# EAGLE schematic beaconboard (EAGLE 6.5.0)
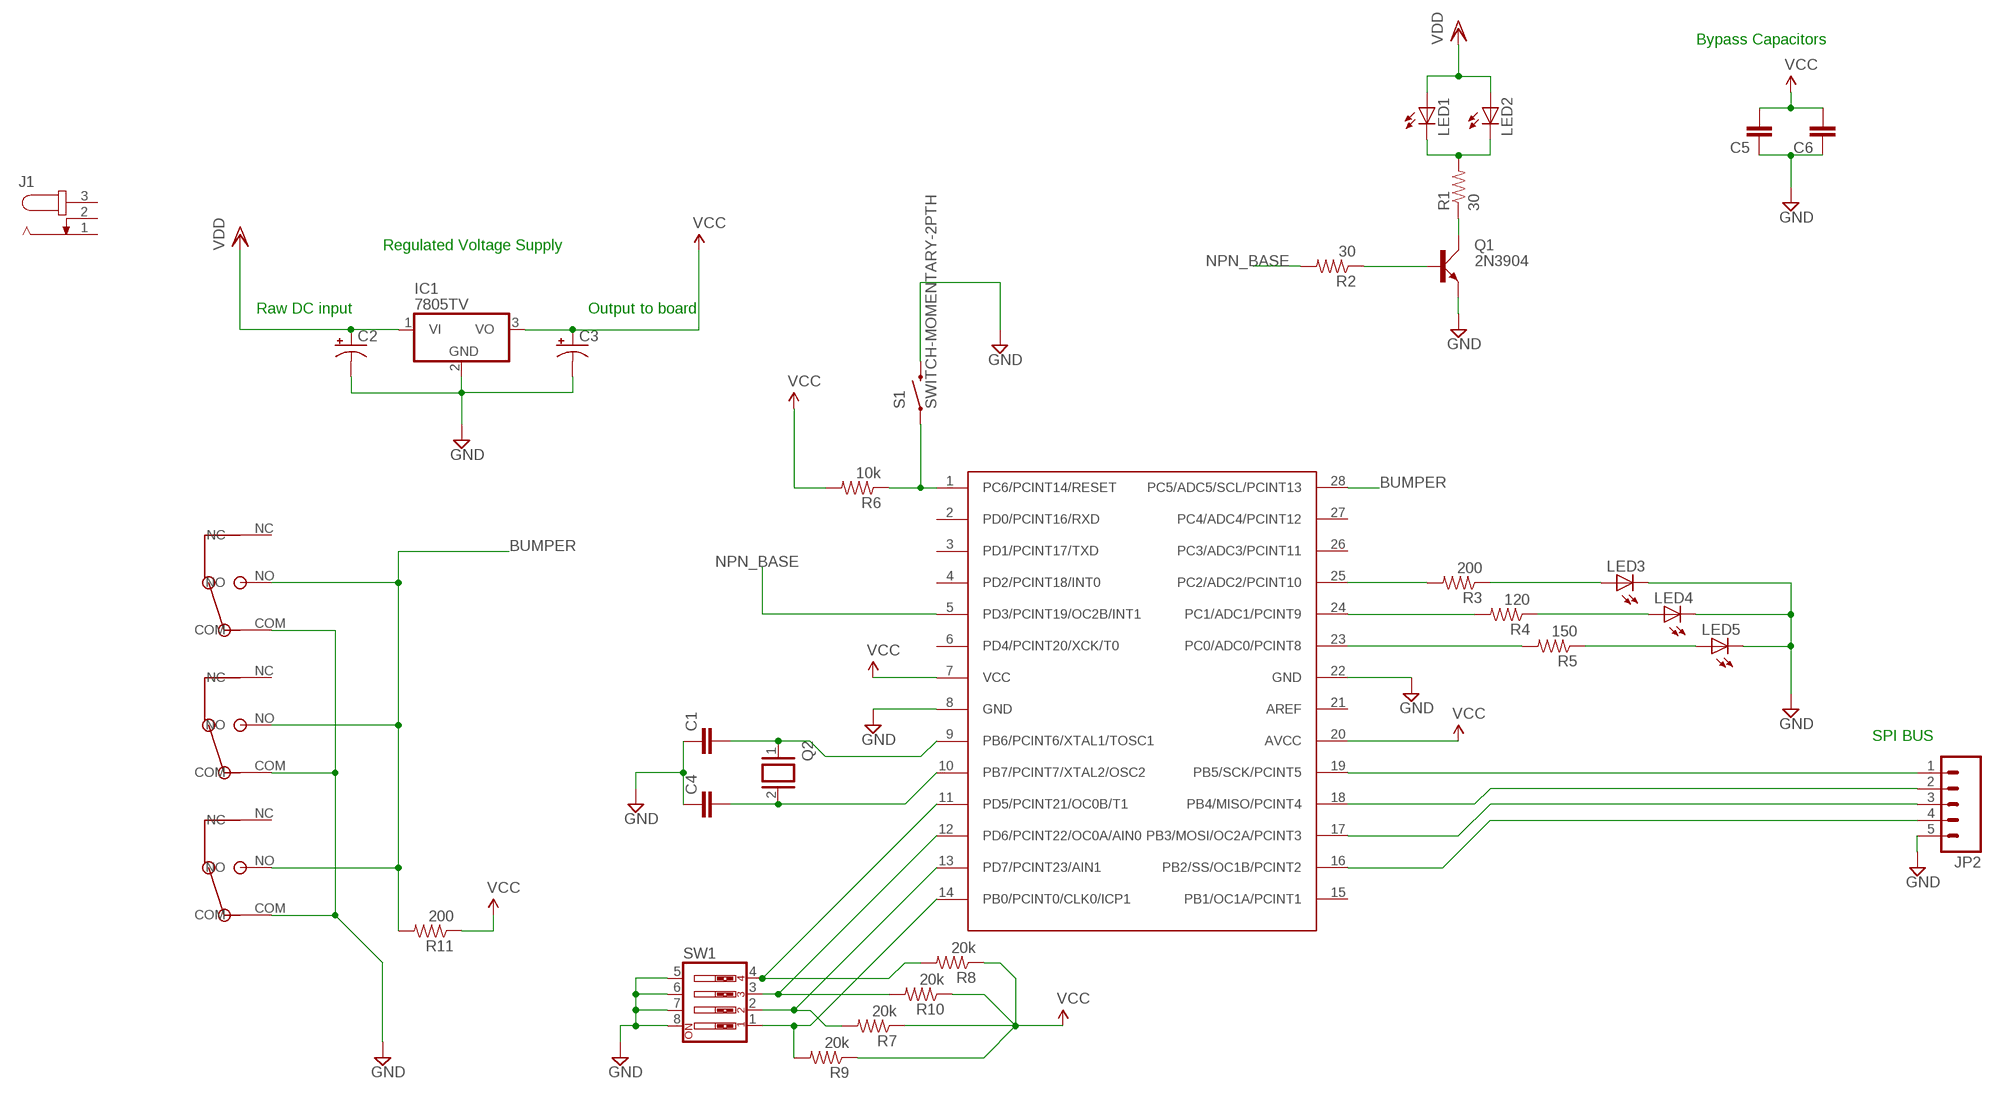
[diagram p0: schematic, sheet 1]

## Parts
C1  CAPPTH  [CAP-PTH-SMALL]
C2  CAP_POLPTH2  [CPOL-RADIAL-10UF-25V]
C3  CAP_POLPTH2  [CPOL-RADIAL-10UF-25V]
C4  CAPPTH  [CAP-PTH-SMALL]
C5  CAPPTH  [CAP-PTH-SMALL]
C6  CAPPTH  [CAP-PTH-SMALL]
IC1  7805TV  [TO220V]
J1  JACK-PLUG1  [SPC4078]
JP2  M05LOCK_LONGPADS  [1X05_LOCK_LONGPADS]
LED1  LED-2AC-CP41B-WES  [CP41B]
LED2  LED-2AC-CP41B-WES  [CP41B]
LED3  LED5MM  [LED5MM]
LED4  LED5MM  [LED5MM]
LED5  LED5MM  [LED5MM]
Q1  2N3904  [TO92D]
Q2  XTAL/S  [QS]
R1  30  RESISTORPTH-1/4W  [AXIAL-0.4]
R2  30  RESISTORPTH-1/4W  [AXIAL-0.4]
R3  200  RESISTORPTH-1/4W  [AXIAL-0.4]
R4  120  RESISTORPTH-1/4W  [AXIAL-0.4]
R5  150  RESISTORPTH-1/4W  [AXIAL-0.4]
R6  10k  RESISTORPTH-1/4W  [AXIAL-0.4]
R7  20k  RESISTORPTH-1/4W  [AXIAL-0.4]
R8  20k  RESISTORPTH-1/4W  [AXIAL-0.4]
R9  20k  RESISTORPTH-1/4W  [AXIAL-0.4]
R10  20k  RESISTORPTH-1/4W  [AXIAL-0.4]
R11  200  RESISTORPTH-1/4W  [AXIAL-0.4]
S1  SWITCH-MOMENTARY-2PTH  [TACTILE-PTH]
SW1  SW_DIP-4  [EDG-04]
U$1  DF2-L  [D2F-L]
U$2  DF2-L  [D2F-L]
U$3  DF2-L  [D2F-L]
U$4  ATMEGA328  [DIL28-3]

## Nets
BUMPER: R11.P$2 U$1.NO U$2.NO U$3.NO U$4.28(PC5/ADC5/SCL/PCINT13)
GND: C1.1 C2.2(-) C3.2(-) C4.1 C5.1 C6.1 IC1.2(GND) JP2.5 LED3.K(C) LED4.K(C) LED5.K(C) Q1.E S1.3 SW1.5 SW1.6 SW1.7 SW1.8 U$1.COM U$2.COM U$3.COM U$4.8(GND) U$4.22(GND)
N$1: Q1.C R1.P$1
N$2: Q1.B R2.P$1
N$3: LED1.1(C) LED1.4(C) LED2.1(C) LED2.4(C) R1.P$2
N$4: R4.P$2 U$4.24(PC1/ADC1/PCINT9)
N$5: JP2.1 U$4.19(PB5/SCK/PCINT5)
N$6: JP2.2 U$4.18(PB4/MISO/PCINT4)
N$7: JP2.3 U$4.17(PB3/MOSI/OC2A/PCINT3)
N$8: LED3.A R3.P$1
N$9: LED4.A R4.P$1
N$10: LED5.A R5.P$1
N$11: R6.P$1 S1.1 U$4.1(PC6/PCINT14/RESET)
N$12: C1.2 Q2.1 U$4.9(PB6/PCINT6/XTAL1/TOSC1)
N$13: C4.2 Q2.2 U$4.10(PB7/PCINT7/XTAL2/OSC2)
N$14: R7.P$2 SW1.2 U$4.13(PD7/PCINT23/AIN1)
N$15: R8.P$2 SW1.4 U$4.11(PD5/PCINT21/OC0B/T1)
N$16: R10.P$2 SW1.3 U$4.12(PD6/PCINT22/OC0A/AIN0)
N$17: R5.P$2 U$4.23(PC0/ADC0/PCINT8)
N$18: R3.P$2 U$4.25(PC2/ADC2/PCINT10)
N$19: R9.P$2 SW1.1 U$4.14(PB0/PCINT0/CLK0/ICP1)
N$20: JP2.4 U$4.16(PB2/SS/OC1B/PCINT2)
NPN_BASE: R2.P$2 U$4.5(PD3/PCINT19/OC2B/INT1)
VCC: C3.1(+) C5.2 C6.2 IC1.3(VO) R6.P$2 R7.P$1 R8.P$1 R9.P$1 R10.P$1 R11.P$1 U$4.7(VCC) U$4.20(AVCC)
VDD: C2.1(+) IC1.1(VI) LED1.2(A) LED1.3(A) LED2.2(A) LED2.3(A)
Unconnected: J1.1 J1.2 J1.3 U$1.NC U$2.NC U$3.NC U$4.2(PD0/PCINT16/RXD) U$4.3(PD1/PCINT17/TXD) U$4.4(PD2/PCINT18/INT0) U$4.6(PD4/PCINT20/XCK/T0) U$4.15(PB1/OC1A/PCINT1) U$4.21(AREF) U$4.26(PC3/ADC3/PCINT11) U$4.27(PC4/ADC4/PCINT12)

## Notes on the sheet
- Bypass Capacitors
- Regulated Voltage Supply
- Raw DC input | Output to board
- SPI BUS

## Library data of the parts
C1 C4-C6 = SparkFun-Passives:CAP: Capacitor Standard 0603 ceramic capacitor, and 0.1" leaded capacitor.
C2 C3 = SparkFun-Capacitors:CAP_POL: Capacitor Polarized These are standard SMD and PTH capacitors. Normally 10uF, 47uF, and 100uF in electrolytic and tantalum varieties. Always verify the external diameter of the through hole cap, it varies with capacity, voltage, and manufacturer. The EIA devices should be standard.
IC1 = linear:78*: Positive VOLTAGE REGULATOR Source: http://cache.national.com/ds/LM/LM78L05.pdf http://www.fairchildsemi.com/ds/LM/LM7805.pdf
J1 = con-jack:JACK-PLUG: DC POWER JACK Power Jack, DC, Right Angle, Through Hole, Rated 5A at 16VDC, PC Terminals Distributor: Farnell (www.Farnell.de) Drawing: 84N1161.pdf / 84N1162.pdf Manufacturer: SPC Technology (www.spctechnology.com) Type: SPC4077 / SPC 4078; OC_FARNELL: unknown; OC_NEWARK: unknown
JP2 = SparkFun-Connectors:M05: Header 5 Standard 5-pin 0.1" header. Use with straight break away headers (SKU : PRT-00116), right angle break away headers (PRT-00553), swiss pins (PRT-00743), machine pins (PRT-00117), and female headers (PRT-00115). Molex polarized connector foot print use with SKU : PRT-08230 with associated crimp pins and housings.
LED1 LED2 = led:LED-2AC-: LEDs with 2 Cathode & 2 Anode - Kingbright SUPER FLUX LED LAMP Source: www.us.kingbright.com/images/catalog/SPEC/W7676CPBC-H.pdf Cree® P4 LED CP41B-WES/WGS Source: Data sheet <http://www.cree.com/products/pdf/LEDlamps/CP41B-WES&WGS.pdf>
LED3-LED5 = SparkFun-LED:LED: LEDs Standard schematic elements and footprints for 5mm, 3mm, 1206, and 0603 sized LEDs. 5mm - Spark Fun Electronics SKU : COM-00529 (and others)
Q1 = transistor-small-signal:2N3904: NPN TRANSISTOR
Q2 = special:XTAL/S: CRYSTAL
R1-R11 = SparkFun-Resistors:RESISTOR: Resistor Basic schematic elements and footprints for 0603, 1206, and PTH resistors.
S1 = SparkFun-Electromechanical:SWITCH-MOMENTARY-2: Various NO switches- pushbuttons, reed, etc
SW1 = special:SW_DIP-4: DIP SWITCH
U$1-U$3 = hmcfabstudio:DF2-L
U$4 = hmcfabstudio:ATMEGA328: Atmega328 in a DIL28 package with pin names taken from the datasheet.